# EAGLE design ledDimmer (EAGLE 9.6.2)
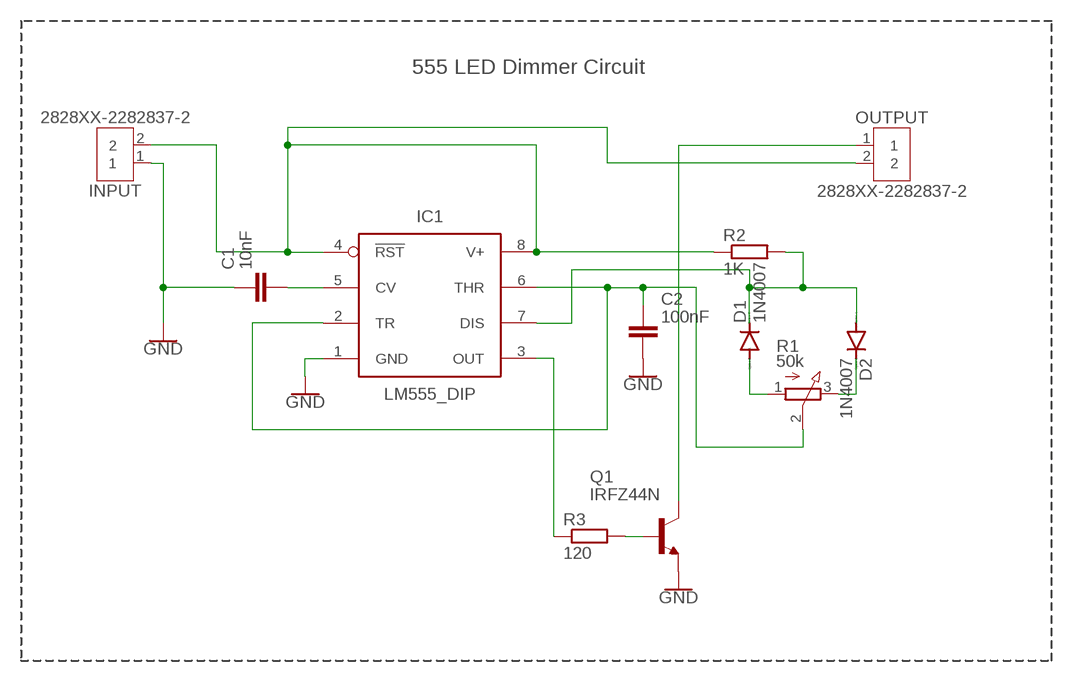
[diagram p0: schematic, sheet 1]

## Parts
C1  10nF  C_CHIP-0402(1005-METRIC)  [CAPC1005X60]
C2  100nF  C_CHIP-0402(1005-METRIC)  [CAPC1005X60]
D1  1N4007  DIODE-DO-214AC  [DO-214AC]
D2  1N4007  DIODE-DO-214AC  [DO-214AC]
IC1  LM555_DIP  [DIP826W53P254L959H508Q8B]
INPUT  2828XX-2282837-2  [TERMBLK_508-2N]
OUTPUT  2828XX-2282837-2  [TERMBLK_508-2N]
Q1  IRFZ44N  2N5496  [TO220]
R1  50k  3RP/1610N  [3RP/1610N]
R2  1K  R-EU_R0402  [R0402]
R3  120  R-EU_R0402  [R0402]

## Nets
GND: C1.1 C2.2 IC1.1(GND) INPUT.1 Q1.3(E)
N$2: C1.2 IC1.5(CV)
N$3: D1.C D2.A IC1.7(DIS) R2.2
N$4: D1.A R1.1(A)
N$5: D2.C R1.3(E)
N$6: IC1.4(!RST) IC1.8(V+) INPUT.2 OUTPUT.2 R2.1
N$7: OUTPUT.1 Q1.2(C)
N$8: C2.1 IC1.2(TR) IC1.6(THR) R1.2(S)
N$9: IC1.3(OUT) R3.1
N$10: Q1.1(B) R3.2

## Notes on the sheet
- 555 LED Dimmer Circuit

## Library data of the parts
C1 C2 = Capacitor:C: Capacitor - Generic; CATEGORY: Capacitor
D1 D2 = diode:DIODE-: DIODE
IC1 = IC_Clock-Timing:*555: TIMER 555 General purpose precision timers NE555 : Texas Datasheet <http://www.ti.com/general/docs/suppproductinfo.tsp?distId=10&gotoUrl=http%3A%2F%2Fwww.ti.com%2Flit%2Fgpn%2Fne555>, Diodes Incorporated Datasheet <https://www.diodes.com/assets/Datasheets/NE555_SA555_NA555.pdf> LM555 Datasheet <http://www.ti.com/general/docs/suppproductinfo.tsp?distId=10&gotoUrl=http%3A%2F%2Fwww.ti.com%2Flit%2Fgpn%2Flm555> LMC555 Datasheet <http://www.ti.com/general/docs/suppproductinfo.tsp?distId=10&gotoUrl=http%3A%2F%2Fwww.ti.com%2Flit%2Fgpn%2Flmc555> ICM7555 : Maxim Integrated Datasheet <https://datasheets.maximintegrated.com/en/ds/ICM7555-ICM7556.pdf>, Renesas Electronics America Inc Datasheet <https://www.renesas.com/en-us/www/doc/datasheet/icm7555-56.pdf>; CATEGORY: IC_Clock-Timing; CURRENT-SUPPLY: 10mA; DESCRIPTION: IC OSC SINGLE TIMER 100KHZ 8-DIP; FREQUENCY: 100kHz; MANUFACTURER: Texas Instruments; MPN: LM555CN/NOPB; OPERATING_TEMP: 0°C to 70°C; PART_STATUS: Active; ROHS_COMPLIANT: ROHS3 Compliant; SUB-CATEGORY: Timer
INPUT OUTPUT = Connector:2828XX-2: 2 Position Wire to Board Terminal Block Horizontal with Board Datasheet <https://www.te.com.cn/commerce/DocumentDelivery/DDEController?Action=showdoc&DocId=Catalog+Section%7F1308389_EUROSTYLE_TERMINAL_BLOCKS%7F0607%7Fpdf%7FEnglish%7FENG_CS_1308389_EUROSTYLE_TERMINAL_BLOCKS_0607.pdf%7F2-282837-5>; CATEGORY: Connector; DESCRIPTION: 2 Position Wire to Board Terminal Block Horizontal with Board 5.08 mm Through Hole; MANUFACTURER: TE Connectivity; MPN: 282837-2; OPERATING_TEMPERATURE: -40°C to +105°C; PART_STATUS: ACTIVE; ROHS_COMPLIANCE: RoHS Compliant; SERIES: 282837; SUBCATEGORY: Terminal Block; TYPE: Side Wire Entry
Q1 = transistor-npn:2N5496: NPN Transistor
R1 = pot:3RP/1610N: 16mm Potentiometer one level Source: http://www.alphapotentiometers.net/html/16mm_pot_2.html
R2 R3 = rcl:R-EU_: RESISTOR, European symbol; SPICEPREFIX: R

## Board
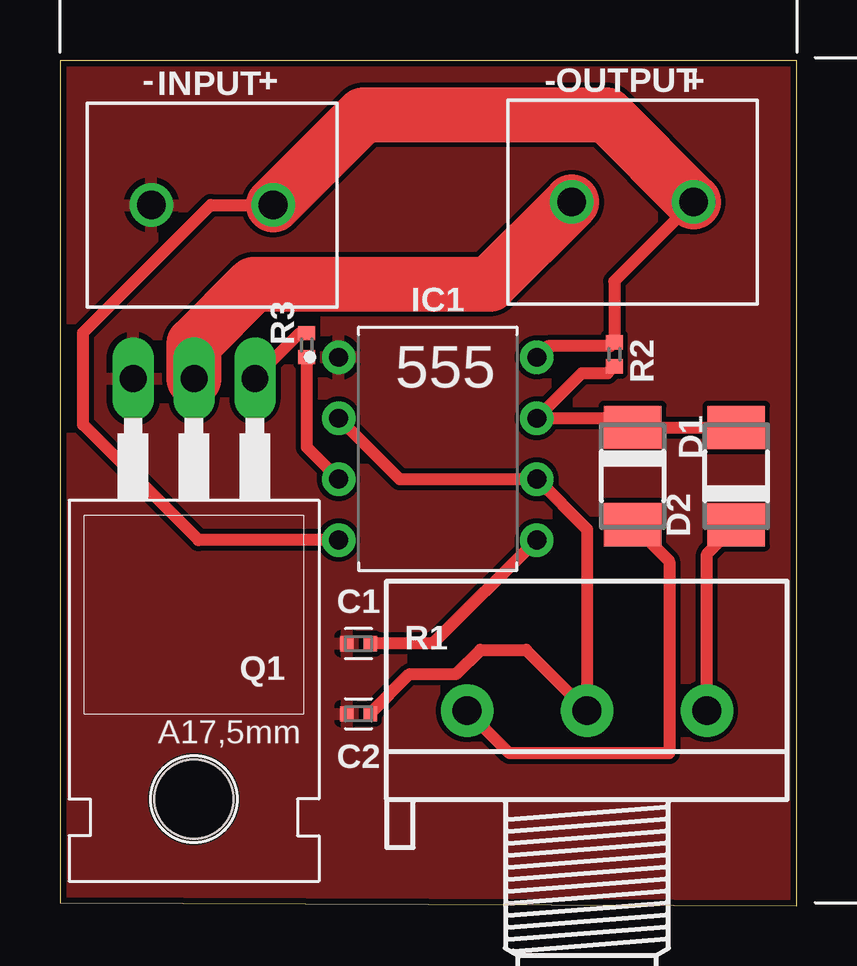
[diagram p1: board, top side]

Size 30.71 x 35.23 mm. Coordinates in mm from the lower left corner, seen from the top.
Outline: 0,0.13 30.71,0 30.71,35.23 0,35.23 0,0.13
Copper layers (1*16): Top 0.035mm / dielectric 1.5mm / Bottom 0.035mm
Design rules "SparkFun": minimum track width 8mil, minimum drill 20mil, track to track 8mil, track to pad 8mil, pad to pad 8mil, via to via 8mil, smd to smd 8mil, copper to edge 10mil, drill to drill 8mil, minimum pad ring 12mil, minimum via ring 10mil, stop-mask expansion 4mil, vias tented up to drill 25mil, thermal gap 10mil

### Footprints (pad centres in the part's own frame; a part is rotated, then mirrored left to right if it is on the bottom)
CAPC1005X60 = smd 0.56 x 0.629: 1 -0.485,0; 2 0.485,0
DO-214AC = smd 1.8 x 2.4: A 2.025,0; C -2.025,0
DIP826W53P254L959H508Q8B = drill 0.786 pad 1.386: 1 -4.13,3.81; 2 -4.13,1.27; 3 -4.13,-1.27; 4 -4.13,-3.81; 5 4.13,-3.81; 6 4.13,-1.27; 7 4.13,1.27; 8 4.13,3.81
TERMBLK_508-2N = drill 1.2: 1 0,0; 2 5.08,0
TO220 = drill 1.118 long: 1 -2.54,-6.35; 2 0,-6.35; 3 2.54,-6.35 | hole 3.302: 0,11.176
3RP/1610N = drill 1.2 pad 2.184: 1 -5,0; 2 0,0; 3 5,0
R0402 = smd 0.6 x 0.7: 1 -0.5,0; 2 0.5,0

### Placement (x,y rotation side)
C1  12.45,10.92 0 top
C2  12.45,8 180 top
D1  23.88,17.91 270 top
D2  28.19,17.91 90 top
IC1  15.75,19.05 0 top
INPUT  3.81,29.21 0 top
OUTPUT  21.34,29.34 0 top
Q1  5.59,15.62 180 top
R1  21.97,8.13 0 top
R2  23.11,22.99 270 top
R3  10.29,23.37 90 top

### Tracks (layer width: path | path; a pad name or v marks a point on that pad's centre or on a via)
GND
  pour Top: -1.02,36.83 31.62,36.83 31.62,-0.89 -1.02,-0.89
N$2
  Top 0.508: IC1.5 15.56,10.92 C1.2
N$3
  Top 0.508: R2.2 22.83,22.2 21.76,22.2 IC1.7 23.49,20.32 D1.C D2.A
N$4
  Top 0.508: D1.A 25.4,14.36 25.4,6.35 18.75,6.35 R1.1
N$5
  Top 0.508: R1.3 26.97,14.66 D2.C
N$6
  Top 0.508: OUTPUT.2 23.11,26.03 R2.1 22.95,23.32 20.34,23.32 IC1.8 | IC1.4 5.78,15.24 0.97,20.05 0.97,23.89 6.29,29.21 INPUT.2
  Top 2.286: INPUT.2 12.65,32.97 22.78,32.97 OUTPUT.2
N$7
  Top 2.286: OUTPUT.1 17.91,25.91 8.08,25.91 5.59,23.42 Q1.2
N$8
  Top 0.508: C2.1 14.58,9.65 16.51,9.65 17.53,10.67 19.43,10.67 R1.2 21.97,15.69 IC1.6 14.16,17.78 IC1.2
N$9
  Top 0.508: R3.1 10.29,19.11 IC1.3
N$10
  Top 0.508: R3.2 9.99,23.87 8.13,22.01 Q1.1

### Text on the board
tNames: - | + | - | + | 555